# Altium schematic sheet BLOCK_DIAGRAM.SchDoc
size A4; SheetNumber: 2; SheetTotal: 9
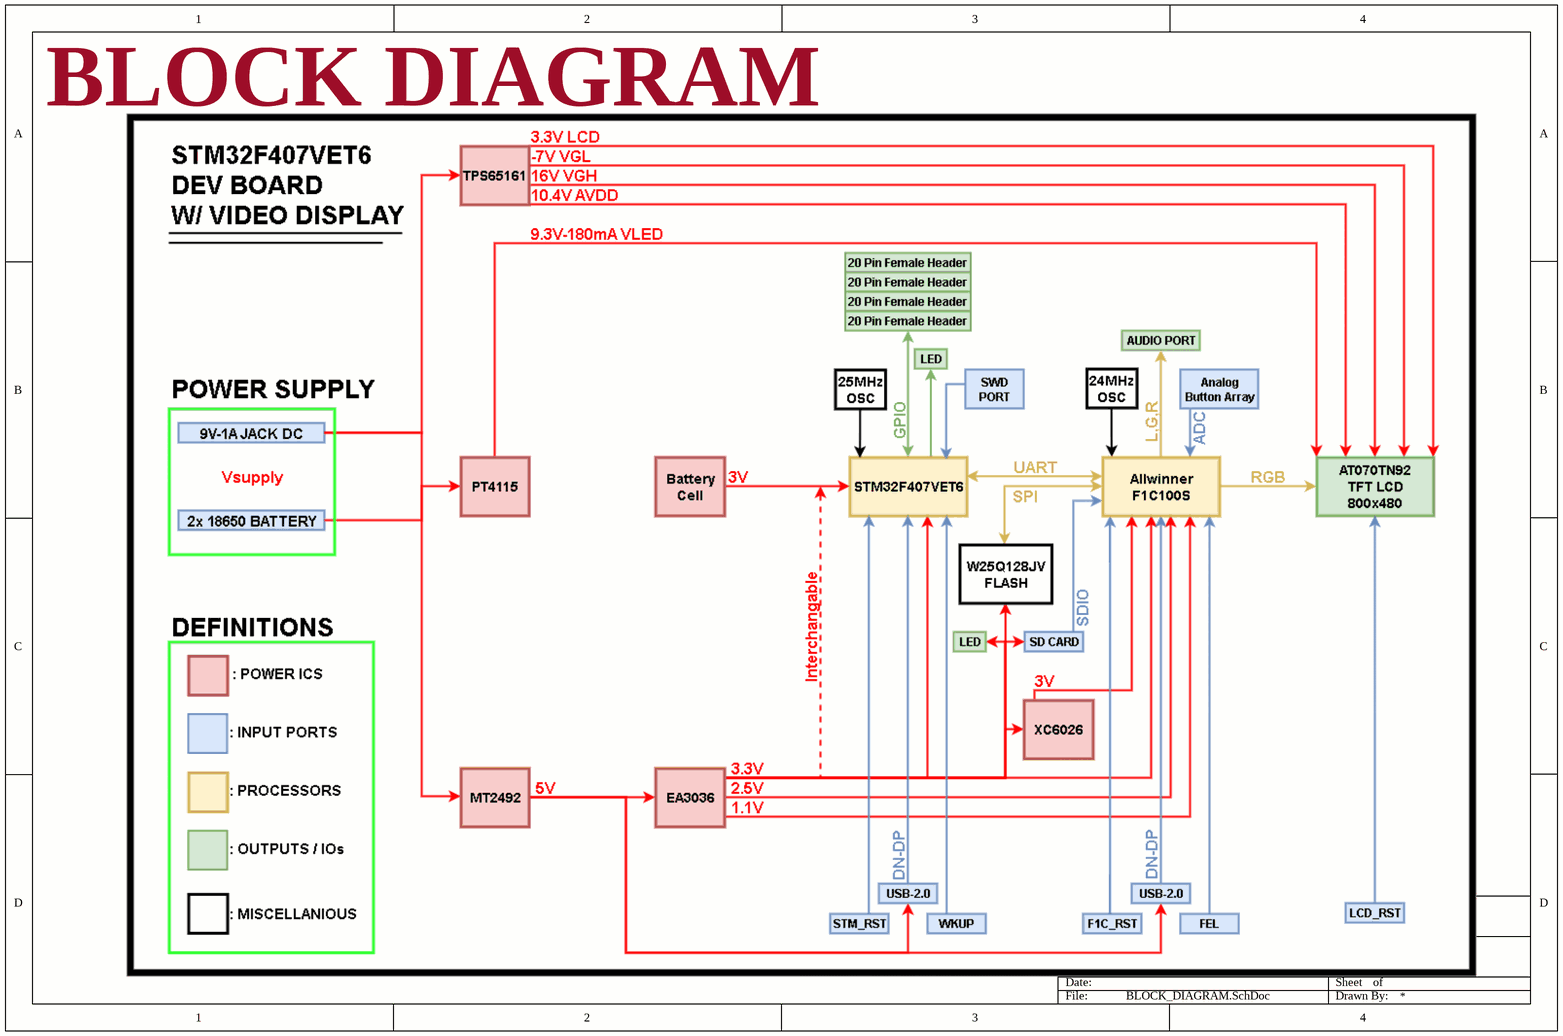
[diagram p0: BLOCK_DIAGRAM.SchDoc]

## Notes on the sheet
- BLOCK DIAGRAM